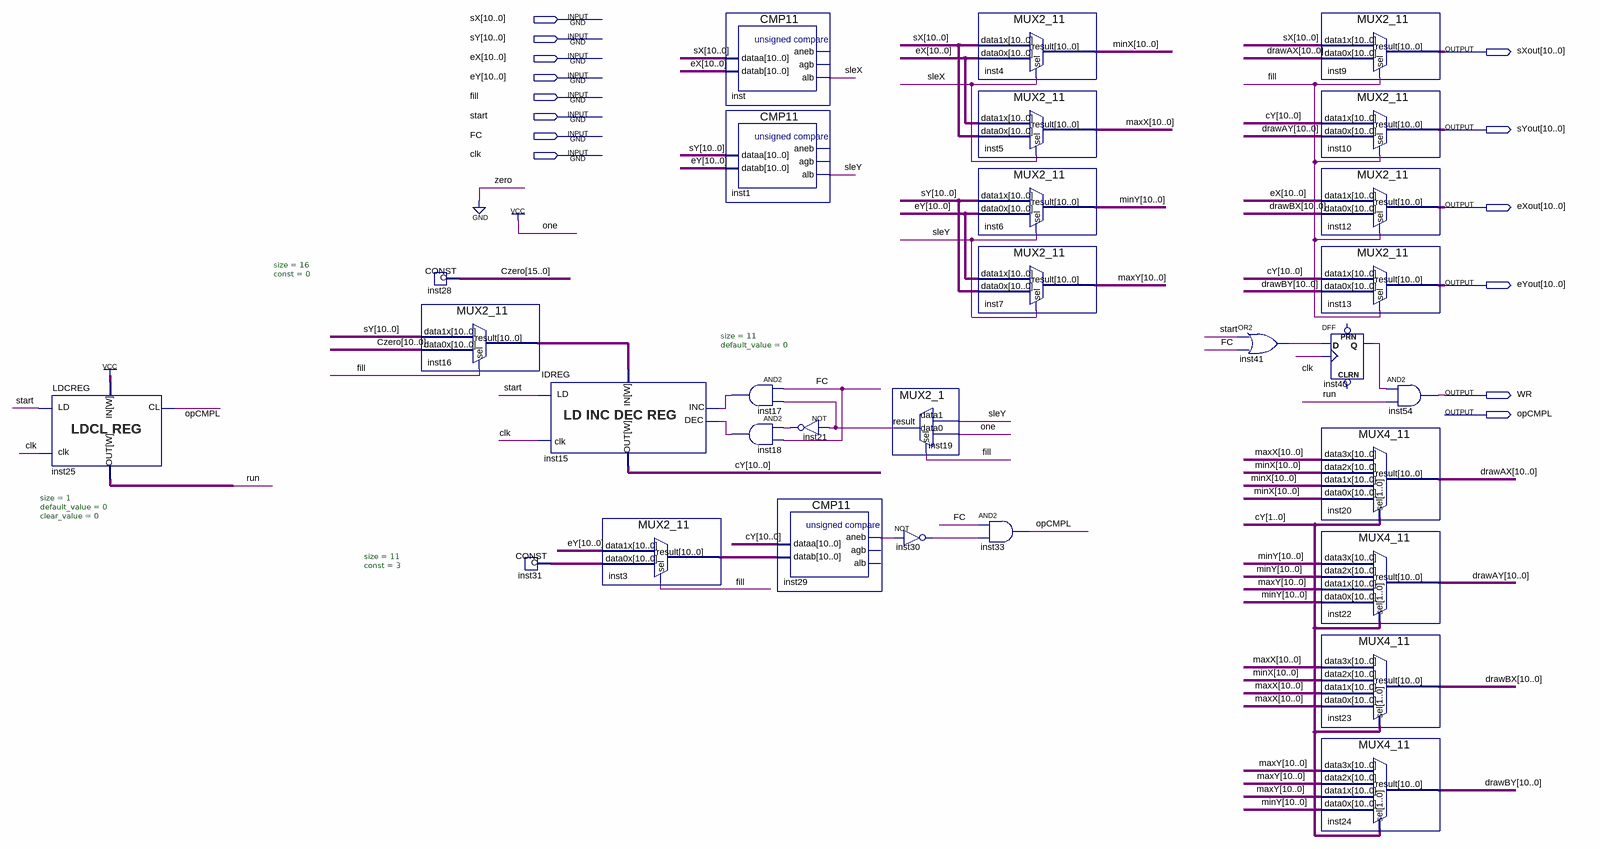
[diagram p0: schematic sheet]
// Quartus schematic RectDrawer.bdf as structural Verilog: 30 symbols, 14 pins
module RectDrawer (
  input  [10:0] sX,
  input  [10:0] sY,
  input  [10:0] eX,
  input  [10:0] eY,
  input  fill,
  input  start,
  input  FC,
  input  clk,
  output [10:0] sXout,
  output [10:0] sYout,
  output [10:0] eXout,
  output [10:0] eYout,
  output WR,
  output opCMPL
);

  wire inst17_out, inst18_out, inst19_result, inst21_out, inst25_data_out, inst29_aneb, inst30_out, inst40_q,
       inst41_out, run, sleX, sleY;
  wire [10:0] cY, drawAX, drawAY, drawBX, drawBY, inst3_result, inst16_result, inst31_data, maxX, maxY, minX,
       minY;
  wire [15:0] Czero;

  LDCREG #(.size(1), .default_value(0), .clear_value(0)) inst25 (
    .clk(clk), .data_in(1'b1), .cl(opCMPL), .ld(start), .data_out(inst25_data_out));
  CONST #(.size(16), .\const (0)) inst28 (.data(Czero));
  MUX2_11 inst16 (.data1x(sY), .data0x(Czero[10:0]), .sel(fill), .result(inst16_result));
  CONST #(.size(11), .\const (3)) inst31 (.data(inst31_data));
  IDREG #(.size(11), .default_value(0)) inst15 (
    .clk(clk), .data_in(inst16_result), .inc(inst17_out), .dec(inst18_out), .ld(start), .data_out(cY));
  MUX2_11 inst3 (.data1x(eY), .data0x(inst31_data), .sel(fill), .result(inst3_result));
  CMP11 inst (.dataa(sX), .datab(eX), .alb(sleX));  // open: aneb, agb
  CMP11 inst1 (.dataa(sY), .datab(eY), .alb(sleY));  // open: aneb, agb
  and inst17 (inst17_out, FC, inst19_result);
  and inst18 (inst18_out, inst21_out, FC);
  CMP11 inst29 (.dataa(cY), .datab(inst3_result), .aneb(inst29_aneb));  // open: agb, alb
  not inst21 (inst21_out, inst19_result);
  MUX2_1 inst19 (.data1(sleY), .data0(1'b1), .sel(fill), .result(inst19_result));
  not inst30 (inst30_out, inst29_aneb);
  MUX2_11 inst4 (.data1x(sX), .data0x(eX), .sel(sleX), .result(minX));
  MUX2_11 inst5 (.data1x(eX), .data0x(sX), .sel(sleX), .result(maxX));
  MUX2_11 inst6 (.data1x(sY), .data0x(eY), .sel(sleY), .result(minY));
  MUX2_11 inst7 (.data1x(eY), .data0x(sY), .sel(sleY), .result(maxY));
  and inst33 (opCMPL, FC, inst30_out);
  or inst41 (inst41_out, start, FC);
  MUX2_11 inst9 (.data1x(sX), .data0x(drawAX), .sel(fill), .result(sXout));
  MUX2_11 inst10 (.data1x(cY), .data0x(drawAY), .sel(fill), .result(sYout));
  MUX2_11 inst12 (.data1x(eX), .data0x(drawBX), .sel(fill), .result(eXout));
  MUX2_11 inst13 (.data1x(cY), .data0x(drawBY), .sel(fill), .result(eYout));
  DFF inst40 (.CLK(clk), .D(inst41_out), .Q(inst40_q));  // open: CLRN, PRN
  MUX4_11 inst20 (.data3x(maxX), .data2x(minX), .data1x(minX), .data0x(minX), .sel(cY[1:0]), .result(drawAX));
  MUX4_11 inst22 (.data3x(minY), .data2x(minY), .data1x(maxY), .data0x(minY), .sel(cY[1:0]), .result(drawAY));
  MUX4_11 inst23 (.data3x(maxX), .data2x(minX), .data1x(maxX), .data0x(maxX), .sel(cY[1:0]), .result(drawBX));
  MUX4_11 inst24 (.data3x(maxY), .data2x(maxY), .data1x(maxY), .data0x(minY), .sel(cY[1:0]), .result(drawBY));
  and inst54 (WR, inst40_q, run);
endmodule
